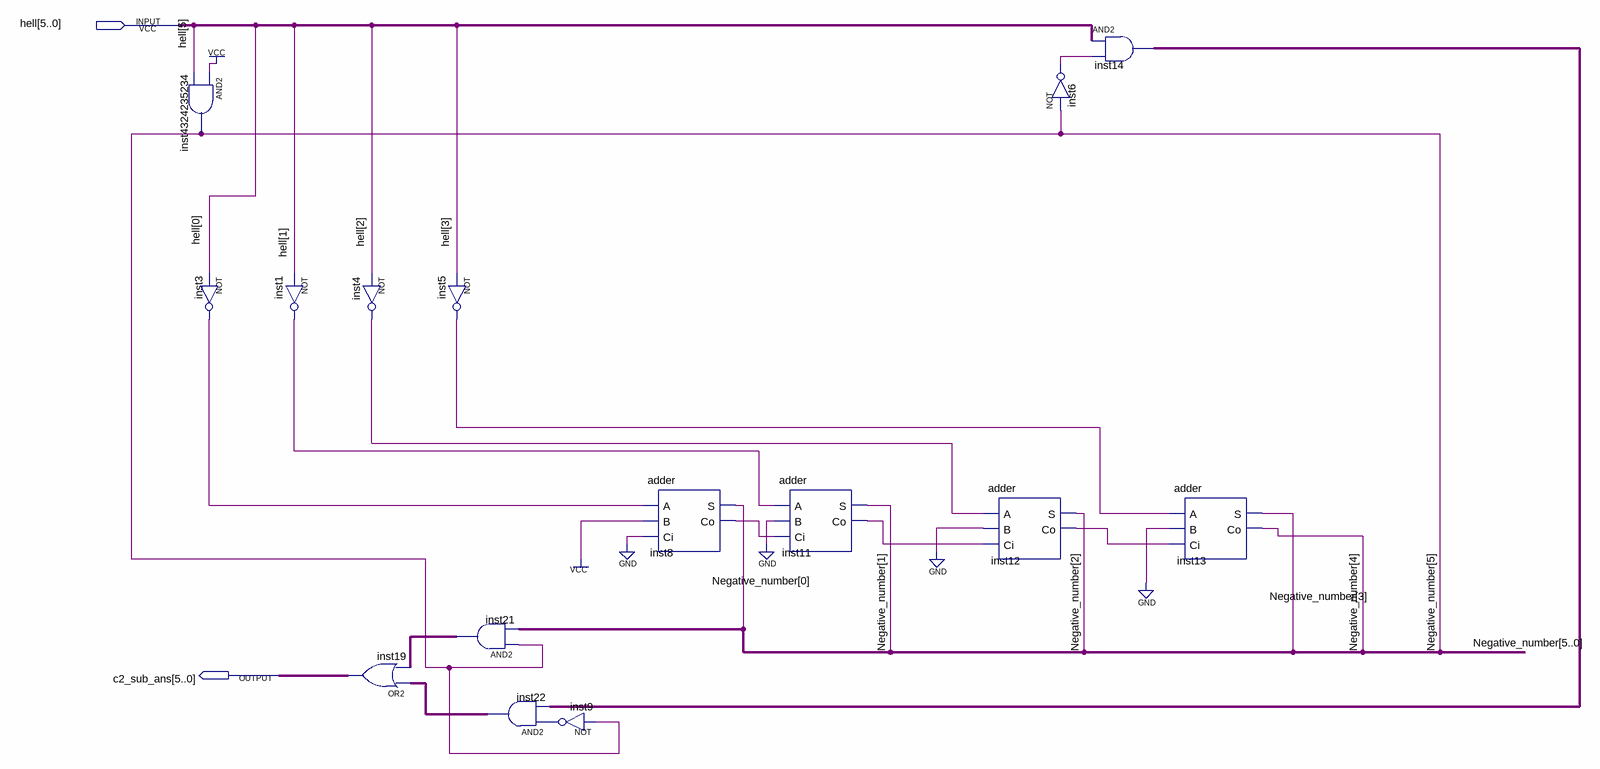
[diagram p0: schematic sheet]
// Quartus schematic c2_module.bdf as structural Verilog: 15 symbols, 2 pins
module c2_module (
  input  [5:0] hell,
  output [5:0] c2_sub_ans
);

  wire inst1_out, inst3_out, inst4_out, inst5_out, inst6_out, inst8_co, inst9_out, inst11_co, inst12_co;
  wire [5:0] inst14_out, inst21_out, inst22_out, Negative_number;

  and inst4324235234 (Negative_number[5], 1'b1, hell[5]);
  not inst3 (inst3_out, hell[0]);
  not inst1 (inst1_out, hell[1]);
  not inst4 (inst4_out, hell[2]);
  assign c2_sub_ans = inst22_out | inst21_out;  // OR2 inst19, 6 bits wide
  not inst5 (inst5_out, hell[3]);
  assign inst21_out = {6{Negative_number[5]}} & Negative_number;  // AND2 inst21, 6 bits wide
  assign inst22_out = {6{inst9_out}} & inst14_out;  // AND2 inst22, 6 bits wide
  not inst9 (inst9_out, Negative_number[5]);
  adder inst8 (.A(inst3_out), .B(1'b1), .Ci(1'b0), .S(Negative_number[0]), .Co(inst8_co));
  adder inst11 (.A(inst1_out), .B(1'b0), .Ci(inst8_co), .S(Negative_number[1]), .Co(inst11_co));
  adder inst12 (.A(inst4_out), .B(1'b0), .Ci(inst11_co), .S(Negative_number[2]), .Co(inst12_co));
  not inst6 (inst6_out, Negative_number[5]);
  assign inst14_out = hell & {6{inst6_out}};  // AND2 inst14, 6 bits wide
  adder inst13 (.A(inst5_out), .B(1'b0), .Ci(inst12_co), .S(Negative_number[3]), .Co(Negative_number[4]));
endmodule
